# Altium schematic sheet S7CAS-PLEIADES-CARTE-MERE_P20_Connectors.SchDoc
size Tabloid; DocumentNumber: 2; SheetNumber: 2; SheetTotal: 2; Sheet_Name: Connectors - Input; Size: 11x17
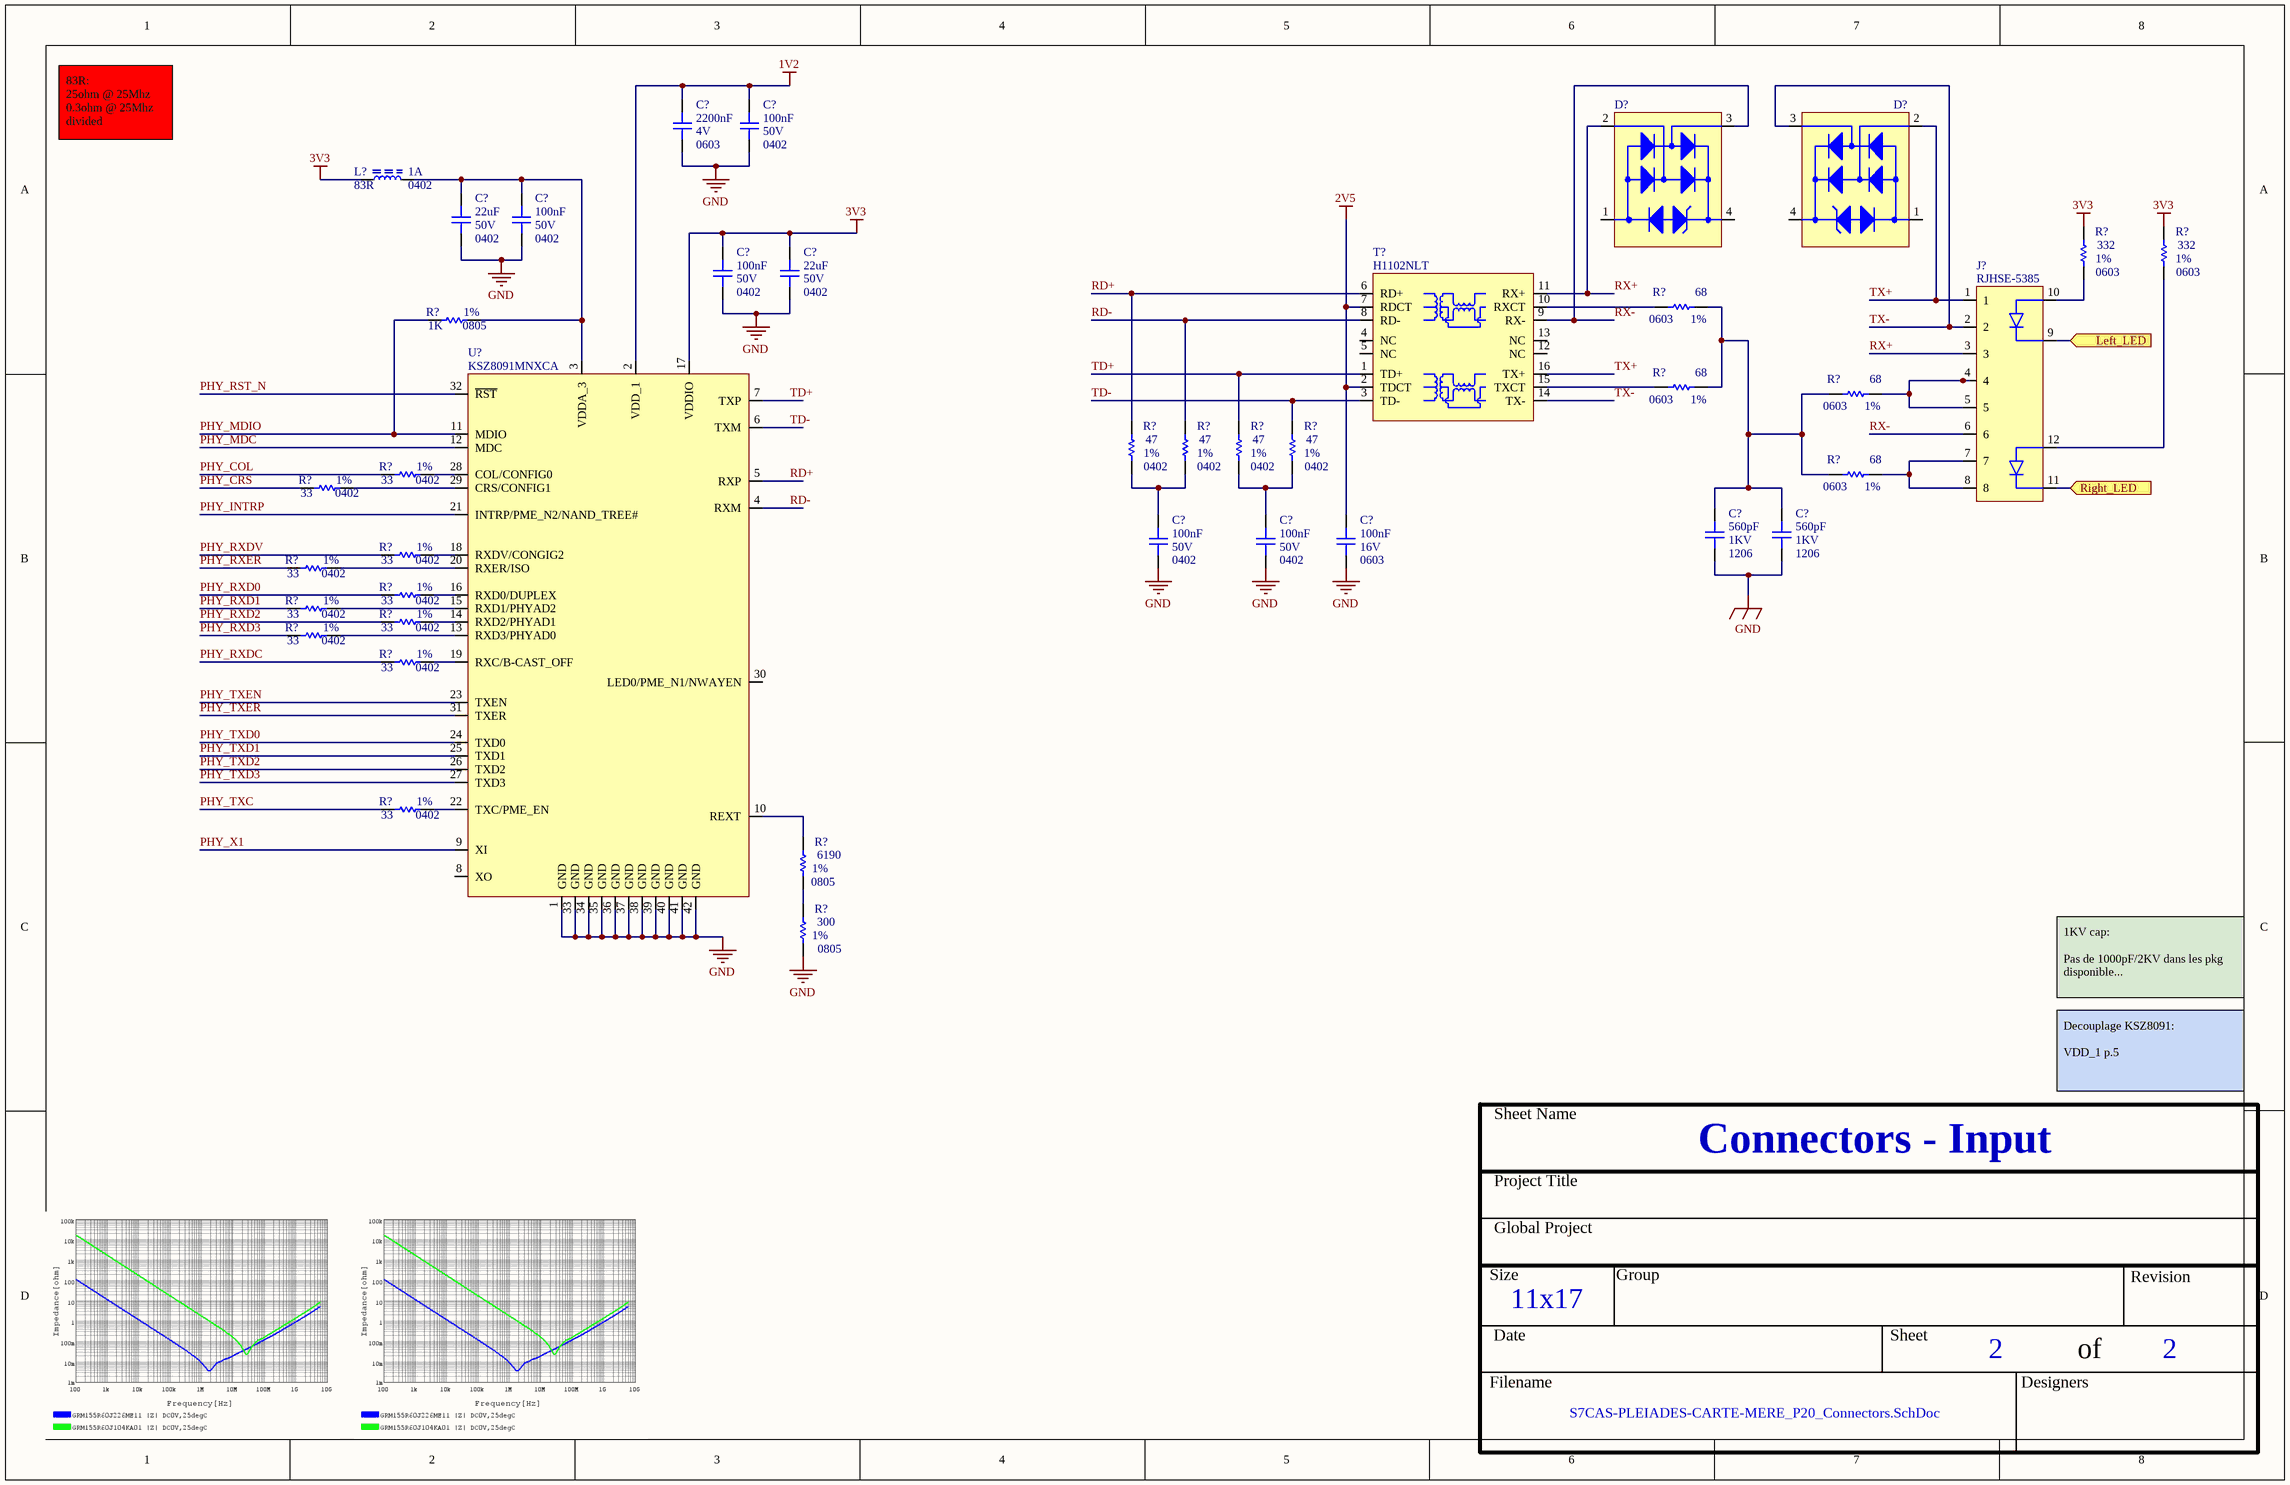
[diagram p0: S7CAS-PLEIADES-CARTE-MERE_P20_Connectors.SchDoc]

## Parts
(Parts that share a designator on the sheet are numbered #1, #2 ... from top to bottom, then left to right.)
C?#1  value 2200nF  Voltage: 4V  Package: 0603  [CAP_0402]  (hidden comment: CAP - 0402)
C?#2  value 100nF  Voltage: 50V  Package: 0402  [CAP_0201]  (hidden comment: CAP - 0201)
C?#3  value 22uF  Voltage: 50V  Package: 0402  [CAP_0402]  (hidden comment: CAP - 0402)
C?#4  value 100nF  Voltage: 50V  Package: 0402  [CAP_0201]  (hidden comment: CAP - 0201)
C?#5  value 100nF  Voltage: 50V  Package: 0402  [CAP_0201]  (hidden comment: CAP - 0201)
C?#6  value 22uF  Voltage: 50V  Package: 0402  [CAP_0402]  (hidden comment: CAP - 0402)
C?#7  value 560pF  Voltage: 1KV  Package: 1206  [CAP_1206]  (hidden comment: CAP - 1206)
C?#8  value 560pF  Voltage: 1KV  Package: 1206  [CAP_1206]  (hidden comment: CAP - 1206)
C?#9  value 100nF  Voltage: 50V  Package: 0402  [CAP_0201]  (hidden comment: CAP - 0201)
C?#10  value 100nF  Voltage: 50V  Package: 0402  [CAP_0201]  (hidden comment: CAP - 0201)
C?#11  value 100nF  Voltage: 16V  Package: 0603  [CAP_0201]  (hidden comment: CAP - 0201)
D?#1  SR3.3.TCT  [TVS_SR3.3.TCT]  (value not drawn)
D?#2  SR3.3.TCT  [TVS_SR3.3.TCT]  (value not drawn)
J?  RJHSE-5385  [CONN_ETHERNET_RJHSE-5385]
L?  value 83R  Current: 1A  Package: 0402  [FER_0402]  (hidden comment: FER - 0402)
R?#1  value 332  Package: 0603  Precision: 1%  [RES_0603]  (hidden comment: RES - 0603)
R?#2  value 332  Package: 0603  Precision: 1%  [RES_0603]  (hidden comment: RES - 0603)
R?#3  value 68  Package: 0603  Precision: 1%  [RES_0402]  (hidden comment: RES - 0402)
R?#4  value 1K  Package: 0805  Precision: 1%  [RES_0402]  (hidden comment: RES - 0402)
R?#5  value 68  Package: 0603  Precision: 1%  [RES_0402]  (hidden comment: RES - 0402)
R?#6  value 68  Package: 0603  Precision: 1%  [RES_0402]  (hidden comment: RES - 0402)
R?#7  value 47  Package: 0402  Precision: 1%  [RES_0402]  (hidden comment: RES - 0402)
R?#8  value 47  Package: 0402  Precision: 1%  [RES_0402]  (hidden comment: RES - 0402)
R?#9  value 47  Package: 0402  Precision: 1%  [RES_0402]  (hidden comment: RES - 0402)
R?#10  value 47  Package: 0402  Precision: 1%  [RES_0402]  (hidden comment: RES - 0402)
R?#11  value 33  Package: 0402  Precision: 1%  [RES_0402]  (hidden comment: RES - 0402)
R?#12  value 68  Package: 0603  Precision: 1%  [RES_0402]  (hidden comment: RES - 0402)
R?#13  value 33  Package: 0402  Precision: 1%  [RES_0402]  (hidden comment: RES - 0402)
R?#14  value 33  Package: 0402  Precision: 1%  [RES_0402]  (hidden comment: RES - 0402)
R?#15  value 33  Package: 0402  Precision: 1%  [RES_0402]  (hidden comment: RES - 0402)
R?#16  value 33  Package: 0402  Precision: 1%  [RES_0402]  (hidden comment: RES - 0402)
R?#17  value 33  Package: 0402  Precision: 1%  [RES_0402]  (hidden comment: RES - 0402)
R?#18  value 33  Package: 0402  Precision: 1%  [RES_0402]  (hidden comment: RES - 0402)
R?#19  value 33  Package: 0402  Precision: 1%  [RES_0402]  (hidden comment: RES - 0402)
R?#20  value 33  Package: 0402  Precision: 1%  [RES_0402]  (hidden comment: RES - 0402)
R?#21  value 33  Package: 0402  Precision: 1%  [RES_0402]  (hidden comment: RES - 0402)
R?#22  value 6190  Package: 0805  Precision: 1%  [RES_0402]  (hidden comment: RES - 0402)
R?#23  value 300  Package: 0805  Precision: 1%  [RES_0805]  (hidden comment: RES - 0805)
T?  H1102NLT  [TRANSFO_H1102NLT]
U?  KSZ8091MNXCA  [COM_ETH_PHY_KSZ8091MNXCA]

## Ports
Left_LED (in), Right_LED (in)

## Nets
1V2: C?#1.2 C?#2.2 U?.2(VDD_1)
2V5: C?#11.2 T?.2(TDCT) T?.7(RDCT)
3V3: C?#5.2 C?#6.2 L?.2 R?#1.2 R?#2.2 U?.17(VDDIO)
GND: C?#1.1 C?#2.1 C?#3.1 C?#4.1 C?#5.1 C?#6.1 C?#7.1 C?#8.1 C?#9.1 C?#10.1 C?#11.1 R?#23.1 U?.1(GND) U?.33(GND) U?.34(GND) U?.35(GND) U?.36(GND) U?.37(GND) U?.38(GND) U?.39(GND) U?.40(GND) U?.41(GND) U?.42(GND)
Left_LED: J?.9(LED1_K) ; port Left_LED
PHY_COL: R?#11.2
PHY_CRS: R?#13.2
PHY_INTRP: U?.21(INTRP/PME_N2/NAND_TREE#)
PHY_MDC: U?.12(MDC)
PHY_MDIO: R?#4.2 U?.11(MDIO)
PHY_RST_N: U?.32(~{RST})
PHY_RXD0: R?#16.2
PHY_RXD1: R?#17.2
PHY_RXD2: R?#18.2
PHY_RXD3: R?#19.2
PHY_RXDC: R?#20.2
PHY_RXDV: R?#14.2
PHY_RXER: R?#15.2
PHY_TXC: R?#21.2
PHY_TXD0: U?.24(TXD0)
PHY_TXD1: U?.25(TXD1)
PHY_TXD2: U?.26(TXD2)
PHY_TXD3: U?.27(TXD3)
PHY_TXEN: U?.23(TXEN)
PHY_TXER: U?.31(TXER)
PHY_X1: U?.9(XI)
RD+: R?#7.2 T?.6(RD+) U?.5(RXP)
RD-: R?#8.2 T?.8(RD-) U?.4(RXM)
Right_LED: J?.11(LED2_K) ; port Right_LED
RX+: D?#1.2(VN) J?.3 T?.11(RX+)
RX-: D?#1.3 J?.6 T?.9(RX-)
TD+: R?#9.2 T?.1(TD+) U?.7(TXP)
TD-: R?#10.2 T?.3(TD-) U?.6(TXM)
TX+: D?#2.2(VN) J?.1 T?.16(TX+)
TX-: D?#2.3 J?.2 T?.14(TX-)
NetC?#3_2: C?#3.2 C?#4.2 L?.1 R?#4.1 U?.3(VDDA_3)
NetC?#7_2: C?#7.2 C?#8.2 R?#3.1 R?#5.1 R?#6.2 R?#12.2
NetC?#9_2: C?#9.2 R?#7.1 R?#8.1
NetC?#10_2: C?#10.2 R?#9.1 R?#10.1
NetJ?_4: J?.4 J?.5 R?#6.1
NetJ?_7: J?.7 J?.8 R?#12.1
NetJ?_10: J?.10(LED1_A) R?#1.1
NetJ?_12: J?.12(LED2_A) R?#2.1
NetR?#3_2: R?#3.2 T?.10(RXCT)
NetR?#5_2: R?#5.2 T?.15(TXCT)
NetR?#11_1: R?#11.1 U?.28(COL/CONFIG0)
NetR?#13_1: R?#13.1 U?.29(CRS/CONFIG1)
NetR?#14_1: R?#14.1 U?.18(RXDV/CONGIG2)
NetR?#15_1: R?#15.1 U?.20(RXER/ISO)
NetR?#16_1: R?#16.1 U?.16(RXD0/DUPLEX)
NetR?#17_1: R?#17.1 U?.15(RXD1/PHYAD2)
NetR?#18_1: R?#18.1 U?.14(RXD2/PHYAD1)
NetR?#19_1: R?#19.1 U?.13(RXD3/PHYAD0)
NetR?#20_1: R?#20.1 U?.19(RXC/B-CAST_OFF)
NetR?#21_1: R?#21.1 U?.22(TXC/PME_EN)
NetR?#22_1: R?#22.1 R?#23.2
NetR?#22_2: R?#22.2 U?.10(REXT)

Not connected (* = marked no-connect by the designer): D?#1 1(I/O) 4; D?#2 1(I/O) 4; T? 4(NC) 5(NC) 12(NC) 13(NC); U? 8(XO) 30(LED0/PME_N1/NWAYEN)

## Notes on the sheet
- 83R:
  25ohm @ 25Mhz
  0.3ohm @ 25Mhz
  divided
- 1KV cap:
  Pas de 1000pF/2KV dans les pkg disponible...
- Decouplage KSZ8091:
  VDD_1 p.5
- Sheet Name
- Project Title
- Global Project
- Size
- Group
- Revision
- Date
- Sheet
- of
- Filename
- Designers

## Library data of the parts
C?#1 = CAP - 0402: Mfg Part Number: GRT188R61H225KE13; Precision: 10%; Current: *; CreatedBy: Jonathan Bouchard; Power: *
C?#2 C?#4 C?#5 = CAP - 0201: Mfg Part Number: GRM155R60J104KA01; Precision: 10%; Current: *; CreatedBy: Jonathan Bouchard; Power: *
C?#3 C?#6 = CAP - 0402: Mfg Part Number: GRM155R60J226ME11; Precision: 10%; Current: *; CreatedBy: Jonathan Bouchard; Power: *
C?#7 C?#8 = CAP - 1206: Precision: 10%; Current: *; CreatedBy: Jonathan Bouchard; Power: *
C?#9 C?#10 = CAP - 0201: Mfg Part Number: GRM155B31H104KE14; Precision: 10%; Current: *; CreatedBy: Jonathan Bouchard; Power: *
C?#11 = CAP - 0201: Mfg Part Number: GCJ188R71C104KA01; Precision: 10%; Current: *; CreatedBy: Jonathan Bouchard; Power: *
D?#1 D?#2 = TVS_SR3.3.TCT: TVS - DIODE ARRAY 3.3V 150W - SOT143-4; Mfg: Semtech; Voltage: VBR=3.3V; Current: *; Mfg Part Number: SR3.3.TCT; HelpURL: http://www.semtech.com/images/datasheet/sr3.3.pdf; CreatedBy: Jonathan Bouchard; Temperature: -55°C to 125°C; Power: 150W; Package: SOT143-4; Precision: *; Value: *; Supplier 1: Digikey; Supplier Part Number 1: SR3.3DKR-ND
J? = CONN_ETHERNET_RJHSE-5385: CONN - MOD JACK RJ45 R/A ETHERNET - TH; Mfg: Amphenol; Voltage: *; Current: *; Power: *; Mfg Part Number: RJHSE-5385; HelpURL: https://www.amphenolcanada.com/ProductSearch/drawings/AC/RJHSE538X.pdf; CreatedBy: Jonathan Bouchard; Temperature: -55°C ~ 85°C; Value: *; Precision: *; Package: TH-12; Supplier 1: Digikey; Supplier Part Number 1: RJHSE-5385-ND
L? = FER - 0402: Mfg Part Number: BLM02BB101SN1; Voltage: *; CreatedBy: Jonathan Bouchard; Power: *; Precision: *
R?#3 R?#5 R?#6 R?#12 = RES - 0402: Mfg Part Number: CRM1206-FX-75R0ELF; Voltage: 50V; Power: 1/5W; Current: *; CreatedBy: Jonathan Bouchard
R?#4 = RES - 0402: Mfg Part Number: CRM0805-FX-1001ELF; Voltage: 50V; Power: 1/16W; Current: *; CreatedBy: Jonathan Bouchard
R?#7-R?#10 = RES - 0402: Mfg Part Number: RL0510S-470-F; Voltage: 50V; Power: 1/16W; Current: *; CreatedBy: Jonathan Bouchard
R?#11 R?#13-R?#21 = RES - 0402: Mfg Part Number: CRCW040233R0FKEDC; Voltage: 50V; Power: 1/16W; Current: *; CreatedBy: Jonathan Bouchard
R?#22 = RES - 0402: Mfg Part Number: CRM0805-FX-6191ELF; Voltage: 50V; Power: 1/16W; Current: *; CreatedBy: Jonathan Bouchard
R?#23 = RES - 0805: Mfg Part Number: CRM0805-FX-1000ELF; Current: *; CreatedBy: Jonathan Bouchard
T? = TRANSFO_H1102NLT: TRANSFO - ETHERNET 10/100B-TX - SMD-16; Mfg: Pulse Eng.; Value: 1:1 (350uH); Voltage: *; Current: *; Power: *; Mfg Part Number: H1102NLT; HelpURL: http://media.digikey.com/pdf/Data%20Sheets/Pulse%20PDFs/10_100BASE-T%20Single%20Port%20SMD%20Magnetics_Rev2008.pdf; CreatedBy: Jonathan Bouchard; Temperature: -40°C to 85°C; Precision: *; Package: SMD-16; Supplier 1: Digikey; Supplier Part Number 1: 553-1532-1-ND
U? = COM_ETH_PHY_KSZ8091MNXCA: COM - ETHERNET PHY 10/100 - QFN-32; Voltage: 1.8V, 2.5V, 3.3V; Mfg: Micrel; Current: *; Power: *; Mfg Part Number: KSZ8091MNXCA; HelpURL: http://ww1.microchip.com/downloads/en/DeviceDoc/00002275A.pdf; CreatedBy: Jonathan Bouchard; Temperature: 0°C ~ 70°C; Value: *; Precision: *; Package: QFN-32; Supplier 1: Digikey; Supplier Part Number 1: 576-4356-ND
R?#1 R?#2 = RES - 0603: Current: *; CreatedBy: Jonathan Bouchard